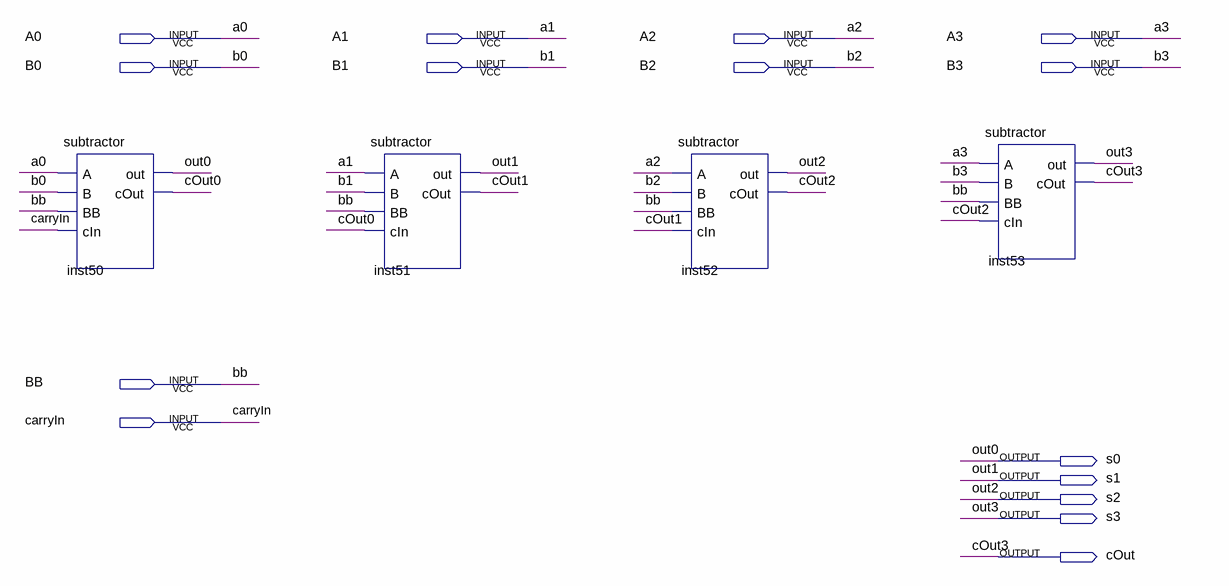
[diagram p0: schematic sheet]
// Quartus schematic adder_subtractor.bdf as structural Verilog: 4 symbols, 15 pins
module adder_subtractor (
  input  A0,
  input  A1,
  input  A2,
  input  A3,
  input  B0,
  input  B1,
  input  B2,
  input  B3,
  input  BB,
  input  carryIn,
  output s0,
  output s1,
  output s2,
  output s3,
  output cOut
);

  wire cOut0, cOut1, cOut2;

  subtractor inst50 (.A(A0), .B(B0), .BB(BB), .cIn(carryIn), .out(s0), .cOut(cOut0));
  subtractor inst51 (.A(A1), .B(B1), .BB(BB), .cIn(cOut0), .out(s1), .cOut(cOut1));
  subtractor inst52 (.A(A2), .B(B2), .BB(BB), .cIn(cOut1), .out(s2), .cOut(cOut2));
  subtractor inst53 (.A(A3), .B(B3), .BB(BB), .cIn(cOut2), .out(s3), .cOut(cOut));

  // Other names for the same wires on the sheet: cOut3 = cOut; out0 = s0; out1 = s1; out2 = s2; out3 = s3
endmodule
